# Altium schematic sheet Dionysus_Main.SchDoc: Block Diagram
size B; CompanyName: Cospan Design; DrawnBy: David McCoy; Engineer: David McCoy; DocumentNumber: 1; SheetNumber: 1; SheetTotal: 8
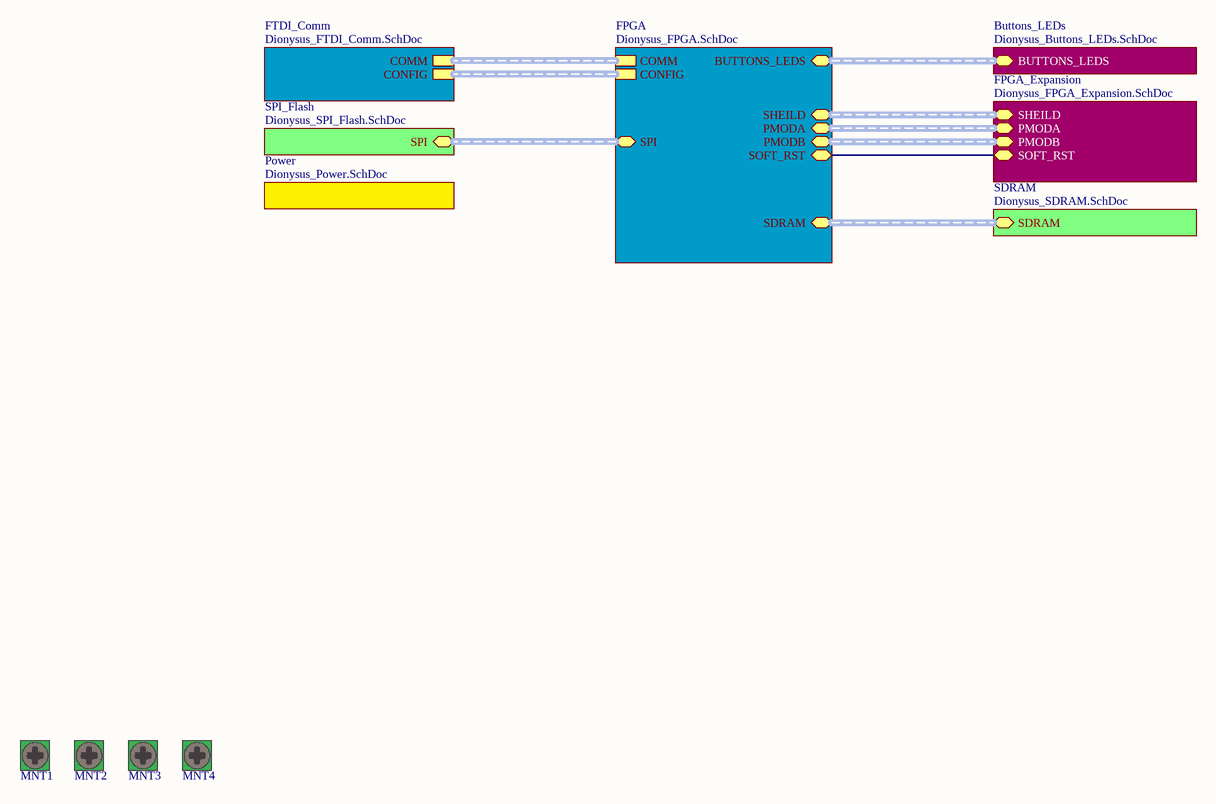
[diagram p0: Dionysus_Main.SchDoc]

## Parts
MNT1  Mounting Hole  [MNT_4-40]  (value not drawn)  (no BOM)
MNT2  Mounting Hole  [MNT_4-40]  (value not drawn)  (no BOM)
MNT3  Mounting Hole  [MNT_4-40]  (value not drawn)  (no BOM)
MNT4  Mounting Hole  [MNT_4-40]  (value not drawn)  (no BOM)

## Sub-sheets
Buttons_LEDs = Dionysus_Buttons_LEDs.SchDoc: BUTTONS_LEDS (harness BUTTON_LED_Harness)
FPGA = Dionysus_FPGA.SchDoc: COMM (harness COMM_Harness), CONFIG (harness CONFIG_Harness), BUTTONS_LEDS (harness BUTTON_LED_Harness), SHEILD (harness SHIELD_Harness), PMODA (harness PMOD_Harness), PMODB (harness PMOD_Harness), SDRAM (harness SDRAM_Harness), SPI (harness SPI_Harness), SOFT_RST
FPGA_Expansion = Dionysus_FPGA_Expansion.SchDoc: SHEILD (harness SHIELD_Harness), PMODA (harness PMOD_Harness), PMODB (harness PMOD_Harness), SOFT_RST
FTDI_Comm = Dionysus_FTDI_Comm.SchDoc: COMM (harness COMM_Harness), CONFIG (harness CONFIG_Harness)
Power = Dionysus_Power.SchDoc: no entries
SDRAM = Dionysus_SDRAM.SchDoc: SDRAM (harness SDRAM_Harness)
SPI_Flash = Dionysus_SPI_Flash.SchDoc: SPI (harness SPI_Harness)

## Nets
(unnamed): sheet FPGA/SOFT_RST, sheet FPGA_Expansion/SOFT_RST

## Buses and harness runs
harness sheet Buttons_LEDs/BUTTONS_LEDS = sheet FPGA/BUTTONS_LEDS
harness sheet FPGA/COMM = sheet FTDI_Comm/COMM
harness sheet FPGA/CONFIG = sheet FTDI_Comm/CONFIG
harness sheet FPGA/PMODA = sheet FPGA_Expansion/PMODA
harness sheet FPGA/PMODB = sheet FPGA_Expansion/PMODB
harness sheet FPGA/SDRAM = sheet SDRAM/SDRAM
harness sheet FPGA/SHEILD = sheet FPGA_Expansion/SHEILD
harness sheet FPGA/SPI = sheet SPI_Flash/SPI

## Notes on the sheet
- Title:
- http://www.cospandesign.com
- Cospan Design
- Project:
- Document:
- Engineer:
- Drawn By:
- Approved By:
- Revision:
- Date:
- Number:
- of

## Library data of the parts
MNT1-MNT4 = MNT_440_HOLE